# EAGLE design LCD_b (EAGLE 7.2.0)
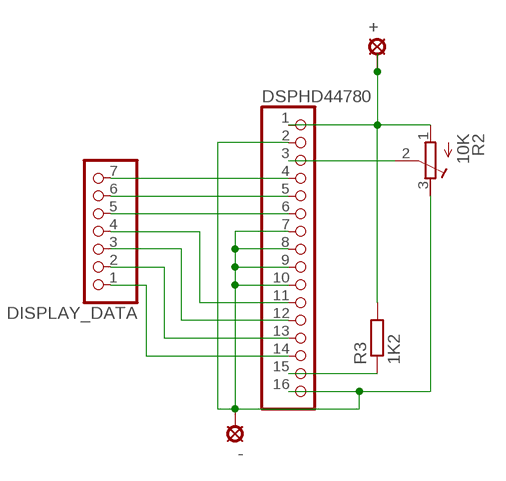
[diagram p0: schematic, sheet 1]

## Parts
+  LSP10  [LSP10]
-  LSP10  [LSP10]
DISPLAY_DATA  PINHD-1X7  [1X07]
DSPHD44780  PINHD-1X16  [1X16]
R2  10K  R-TRIMM3339P  [RTRIM3339P]
R3  1K2  R-EU_0207/10  [0207/10]

## Nets
N$1: -.MP DSPHD44780.2 DSPHD44780.7 DSPHD44780.8 DSPHD44780.9 DSPHD44780.10 DSPHD44780.16 R2.3(E)
N$14: DISPLAY_DATA.5 DSPHD44780.6
N$16: DISPLAY_DATA.6 DSPHD44780.5
N$22: DSPHD44780.15 R3.1
N$99: DISPLAY_DATA.1 DSPHD44780.14
N$104: DISPLAY_DATA.2 DSPHD44780.13
N$105: DISPLAY_DATA.3 DSPHD44780.12
N$106: DISPLAY_DATA.4 DSPHD44780.11
N$107: DISPLAY_DATA.7 DSPHD44780.4
N$109: DSPHD44780.3 R2.2(S)
N$125: +.MP DSPHD44780.1 R2.1(A) R3.2

## Library data of the parts
+ - = solpad:LSP10: SOLDER PAD drill 1.0 mm, distributor Buerklin, 12H555
DISPLAY_DATA = pinhead:PINHD-1X7: PIN HEADER
DSPHD44780 = pinhead:PINHD-1X16: PIN HEADER
R2 = rcl:R-TRIMM: Trimm resistor
R3 = resistor:R-EU_: RESISTOR, European symbol

## Board
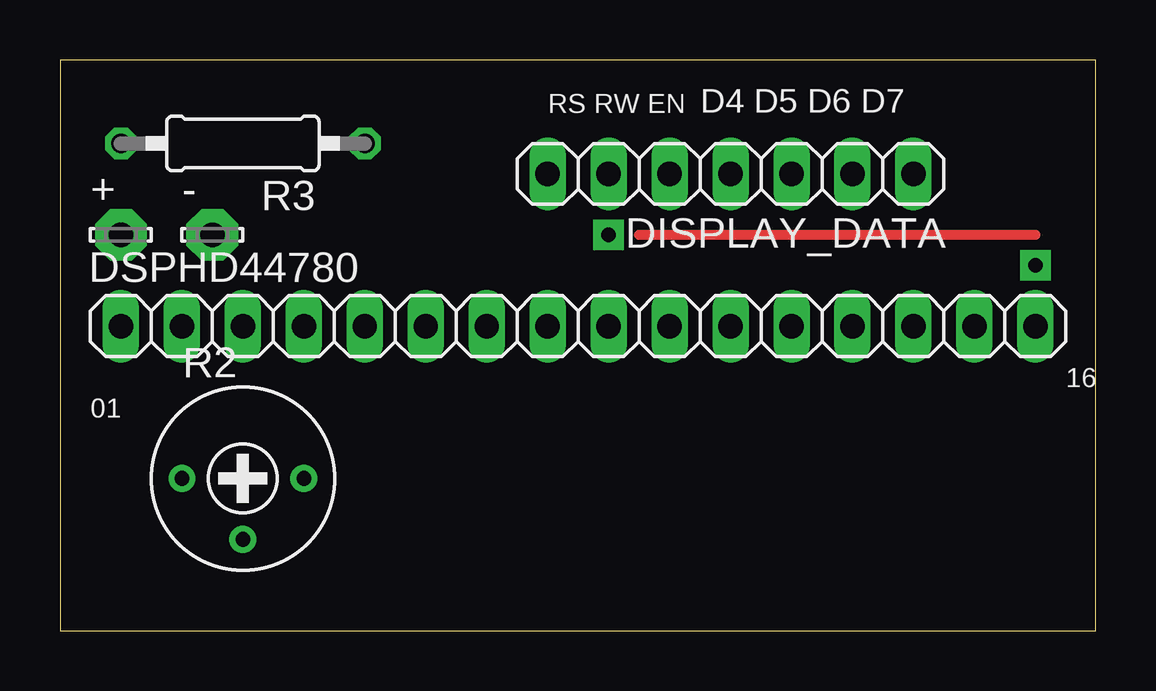
[diagram p1: board, top side]
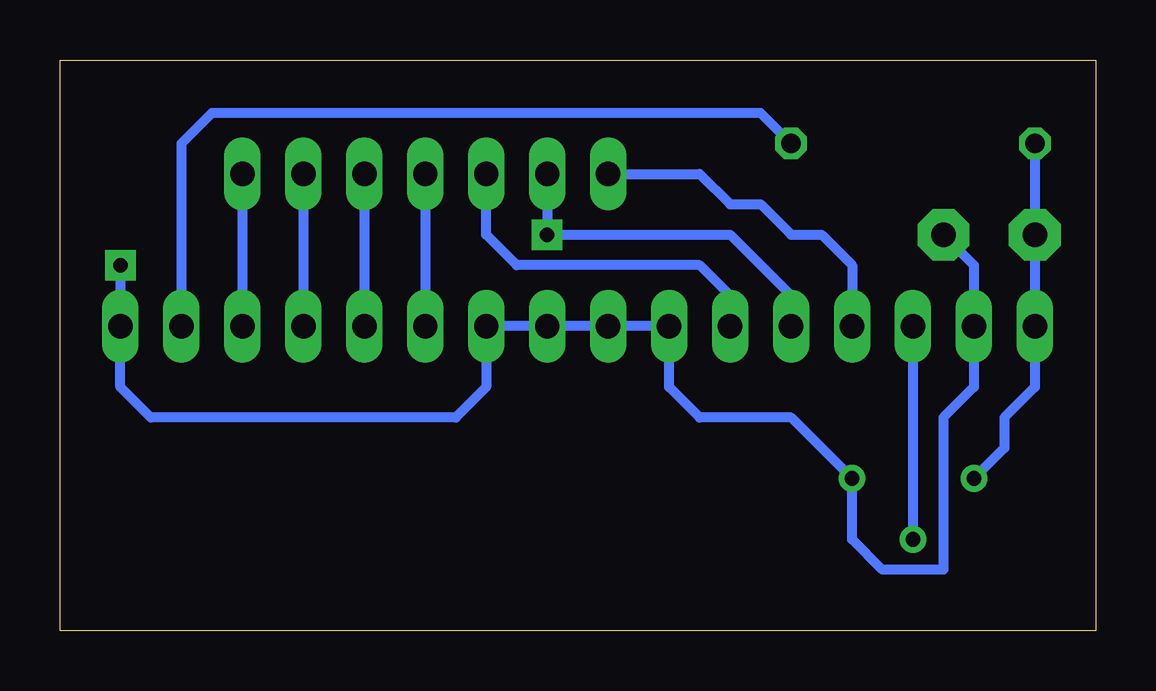
[diagram p2: board, bottom side, seen from below]

Size 43.16 x 23.8 mm. Coordinates in mm from the lower left corner, seen from the top.
Outline: 0,0 43.16,0 43.16,23.8 0,23.8 0,0
Copper layers (1*16): Top 0.035mm / dielectric 1.5mm / Bottom 0.035mm
Design rules "default": minimum track width 10mil, minimum drill 24mil, track to track 8mil, track to pad 8mil, pad to pad 8mil, via to via 8mil, smd to smd 8mil, copper to edge 40mil, drill to drill 8mil, minimum pad ring 10mil, minimum via ring 8mil, stop-mask expansion 4mil, vias tented up to drill 0mil, thermal gap 10mil

### Footprints (pad centres in the part's own frame; a part is rotated, then mirrored left to right if it is on the bottom)
LSP10 = drill 1.016 pad 2.159 octagon: MP 0,0
1X07 = drill 1.016 long: 1 -7.62,0; 2 -5.08,0; 3 -2.54,0; 4 0,0; 5 2.54,0; 6 5.08,0; 7 7.62,0
1X16 = drill 1.016 long: 1 -19.05,0; 2 -16.51,0; 3 -13.97,0; 4 -11.43,0; 5 -8.89,0; 6 -6.35,0; 7 -3.81,0; 8 -1.27,0; 9 1.27,0; 10 3.81,0; 11 6.35,0; 12 8.89,0; 13 11.43,0; 14 13.97,0; 15 16.51,0; 16 19.05,0
RTRIM3339P = drill 0.61: 1 -2.54,0; 2 0,-2.54; 3 2.54,0
0207/10 = drill 0.813 octagon: 1 -5.08,0; 2 5.08,0

### Placement (x,y rotation side)
+  2.54,16.51 0 top
-  6.35,16.51 0 top
DISPLAY_DATA  27.94,19.05 180 top
DSPHD44780  21.59,12.7 0 top
R2  7.62,6.35 0 top
R3  7.62,20.32 180 top

### Tracks (layer width: path | path; a pad name or v marks a point on that pad's centre or on a via)
N$1  (via drill 0.6 pad 1.27)
  Bottom 0.406: -.MP 5.08,15.24 DSPHD44780.2 5.08,10.16 6.35,8.89 6.35,2.54 8.89,2.54 10.16,3.81 R2.3 12.7,8.89 16.51,8.89 17.78,10.16 DSPHD44780.7 DSPHD44780.8 DSPHD44780.9 DSPHD44780.10 25.4,10.16 26.67,8.89 39.37,8.89 40.64,10.16 DSPHD44780.16 v40.64,15.24
N$2
  Top 0.406: 24.13,16.51 40.64,16.51
N$14
  Bottom 0.406: DSPHD44780.6 15.24,13.97 16.51,15.24 24.13,15.24 25.4,16.51 DISPLAY_DATA.5
N$16  (via drill 0.6 pad 1.27)
  Bottom 0.406: DISPLAY_DATA.6 v22.86,16.51 15.24,16.51 12.7,13.97 DSPHD44780.5
N$22
  Bottom 0.406: R3.1 13.97,21.59 36.83,21.59 38.1,20.32 DSPHD44780.15
N$99
  Bottom 0.406: DISPLAY_DATA.1 DSPHD44780.14
N$104
  Bottom 0.406: DISPLAY_DATA.2 DSPHD44780.13
N$105
  Bottom 0.406: DISPLAY_DATA.3 DSPHD44780.12
N$106
  Bottom 0.406: DISPLAY_DATA.4 DSPHD44780.11
N$107
  Bottom 0.406: DISPLAY_DATA.7 16.51,19.05 15.24,17.78 13.97,17.78 12.7,16.51 11.43,16.51 10.16,15.24 DSPHD44780.4
N$109
  Bottom 0.406: DSPHD44780.3 R2.2
N$125
  Bottom 0.406: R3.2 +.MP DSPHD44780.1 2.54,10.16 3.81,8.89 3.81,7.62 R2.1

### Text on the board
tPlace: RS RW EN | D4 D5 D6 D7 | 16 | 01